# EasyEDA Pro project Sisyphus.epro, schematic Line_Follower

## Sheets
1 Sensor: Board Name: Board1; Create Date: 2024-11-08; Page Name: Sensor; Project Name: Line Follower 3; Schematic Name: Line_Follower; Update Date: 2024-11-08; Company: EasyEDA.com; Drawn: EasyEDA; Page Size: A4; Part Number: JLCPCB-002; Reviewed: EasyEDA; Version: V0.1
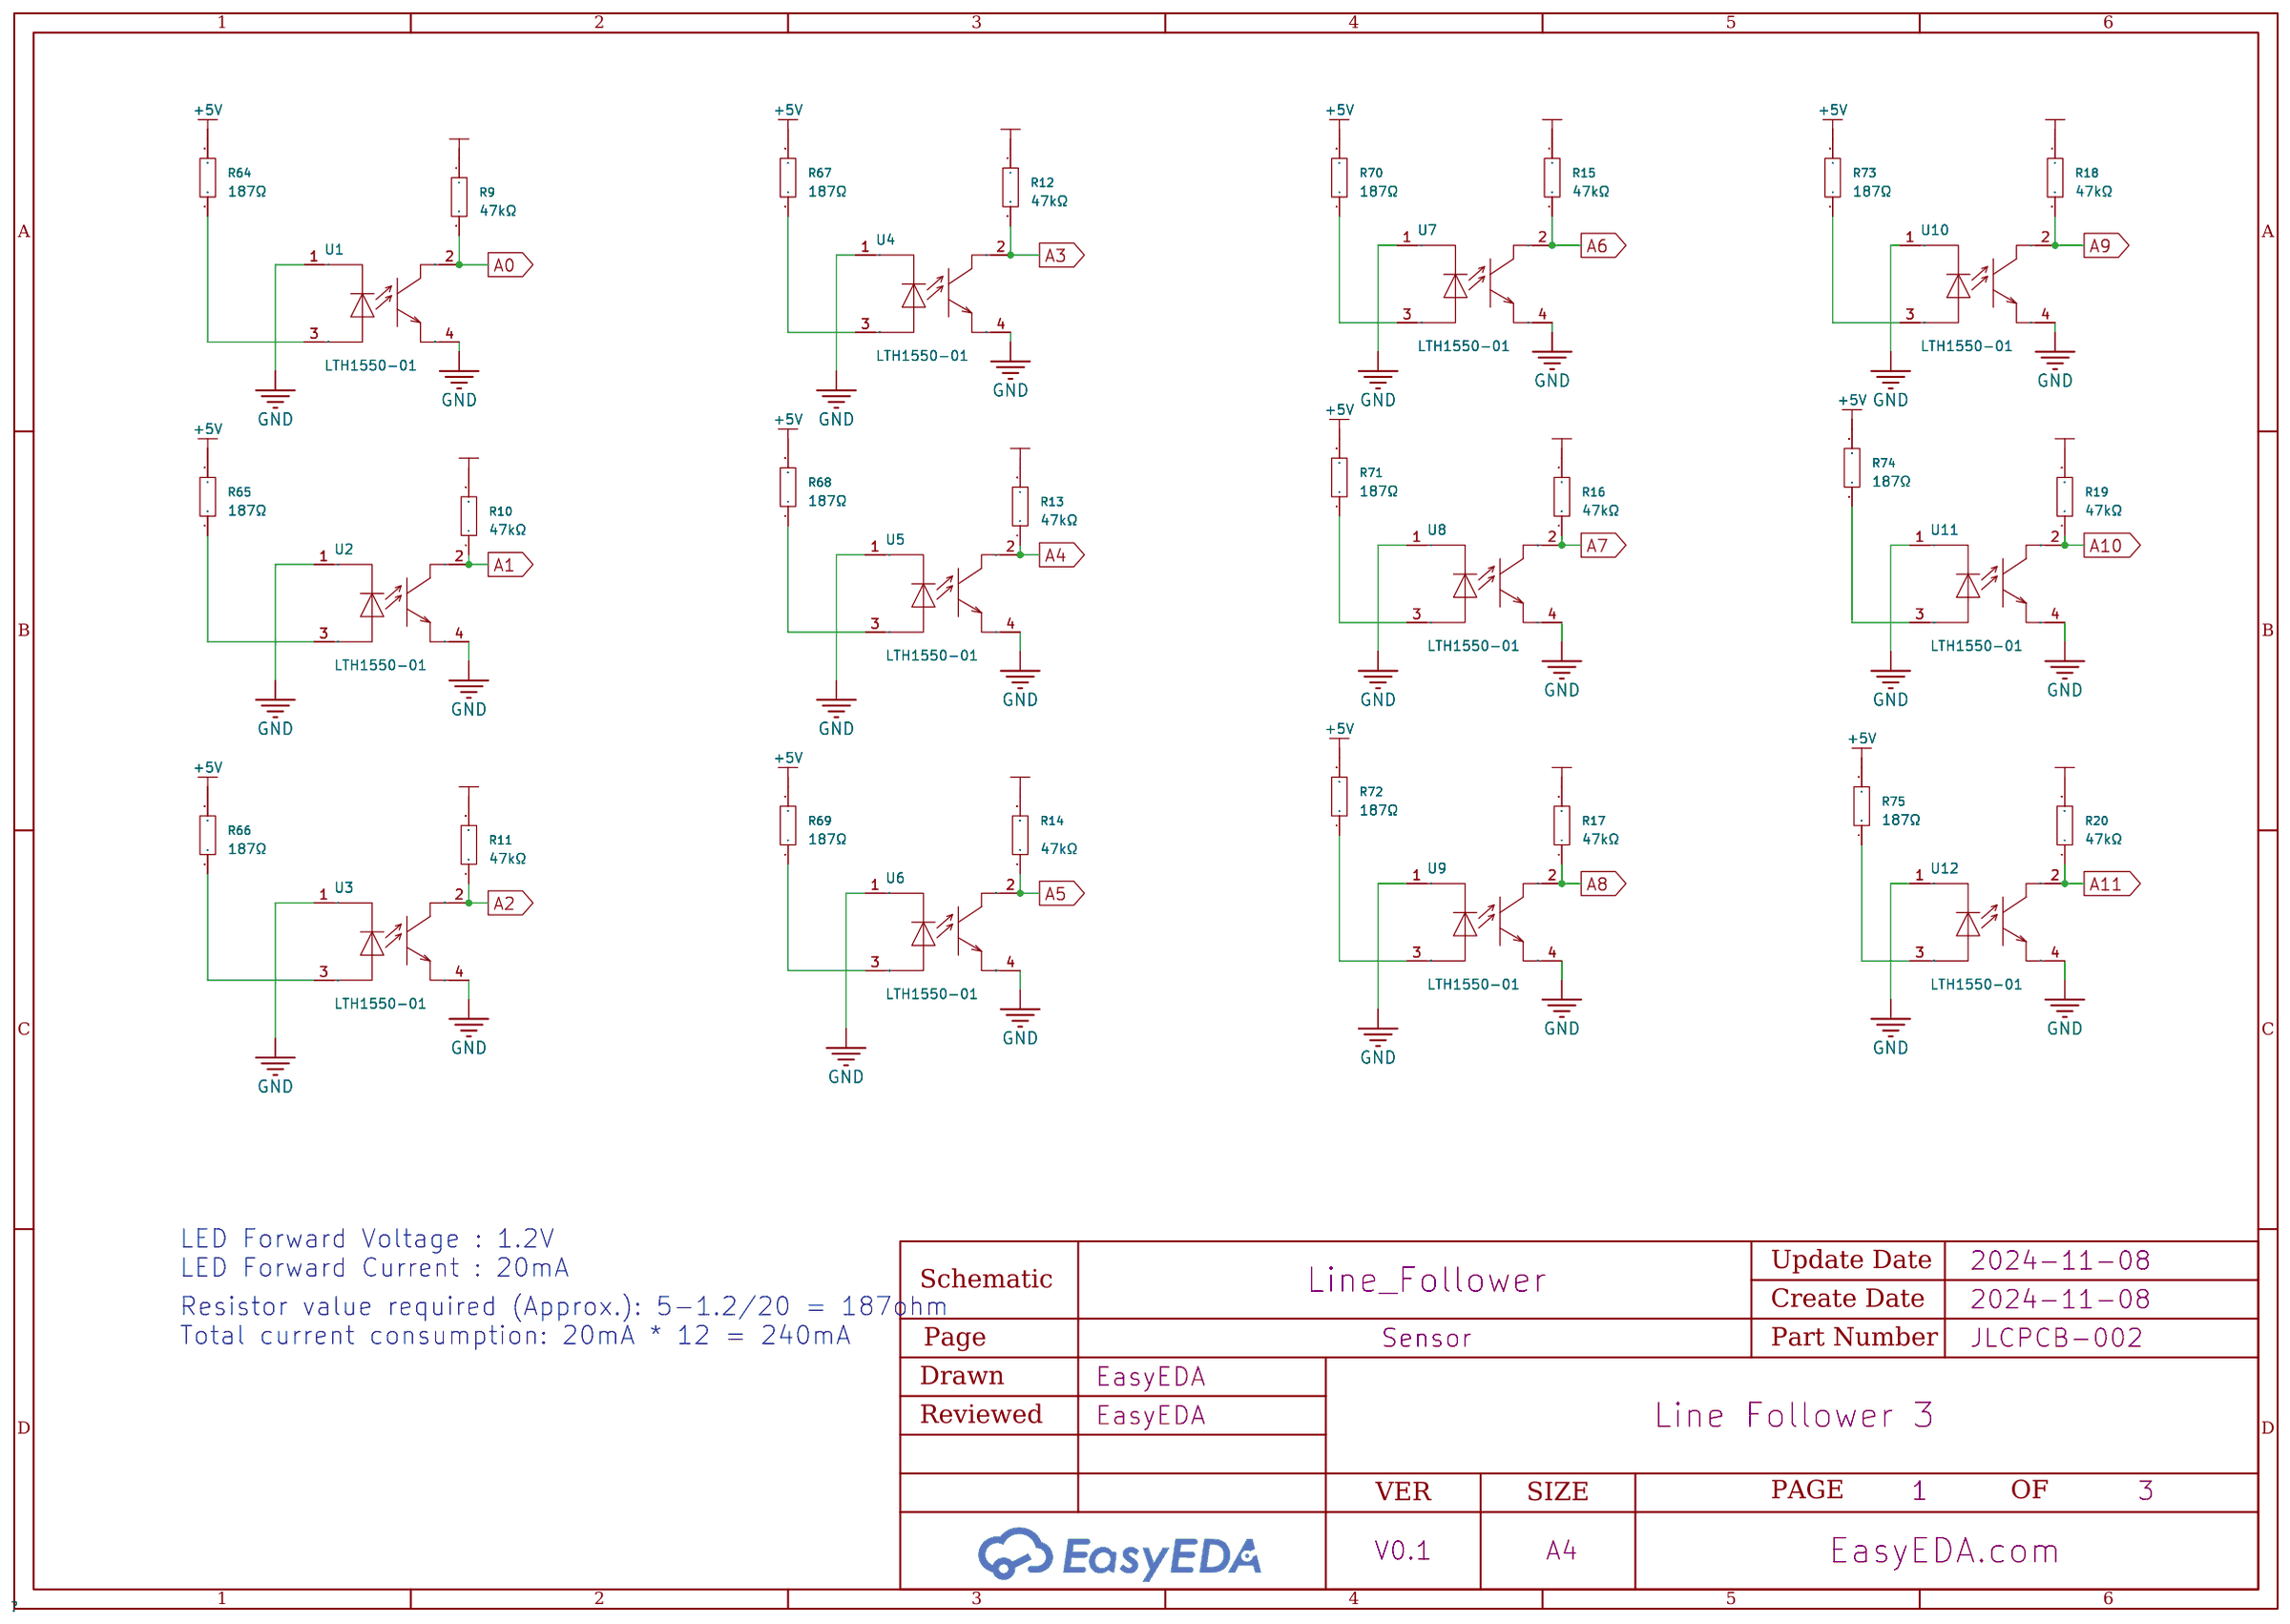
[diagram p0: Sensor]
2 MCU: Create Date: 2025-03-21; Page Name: MCU; Project Name: LineFollow; Update Date: 2025-03-21
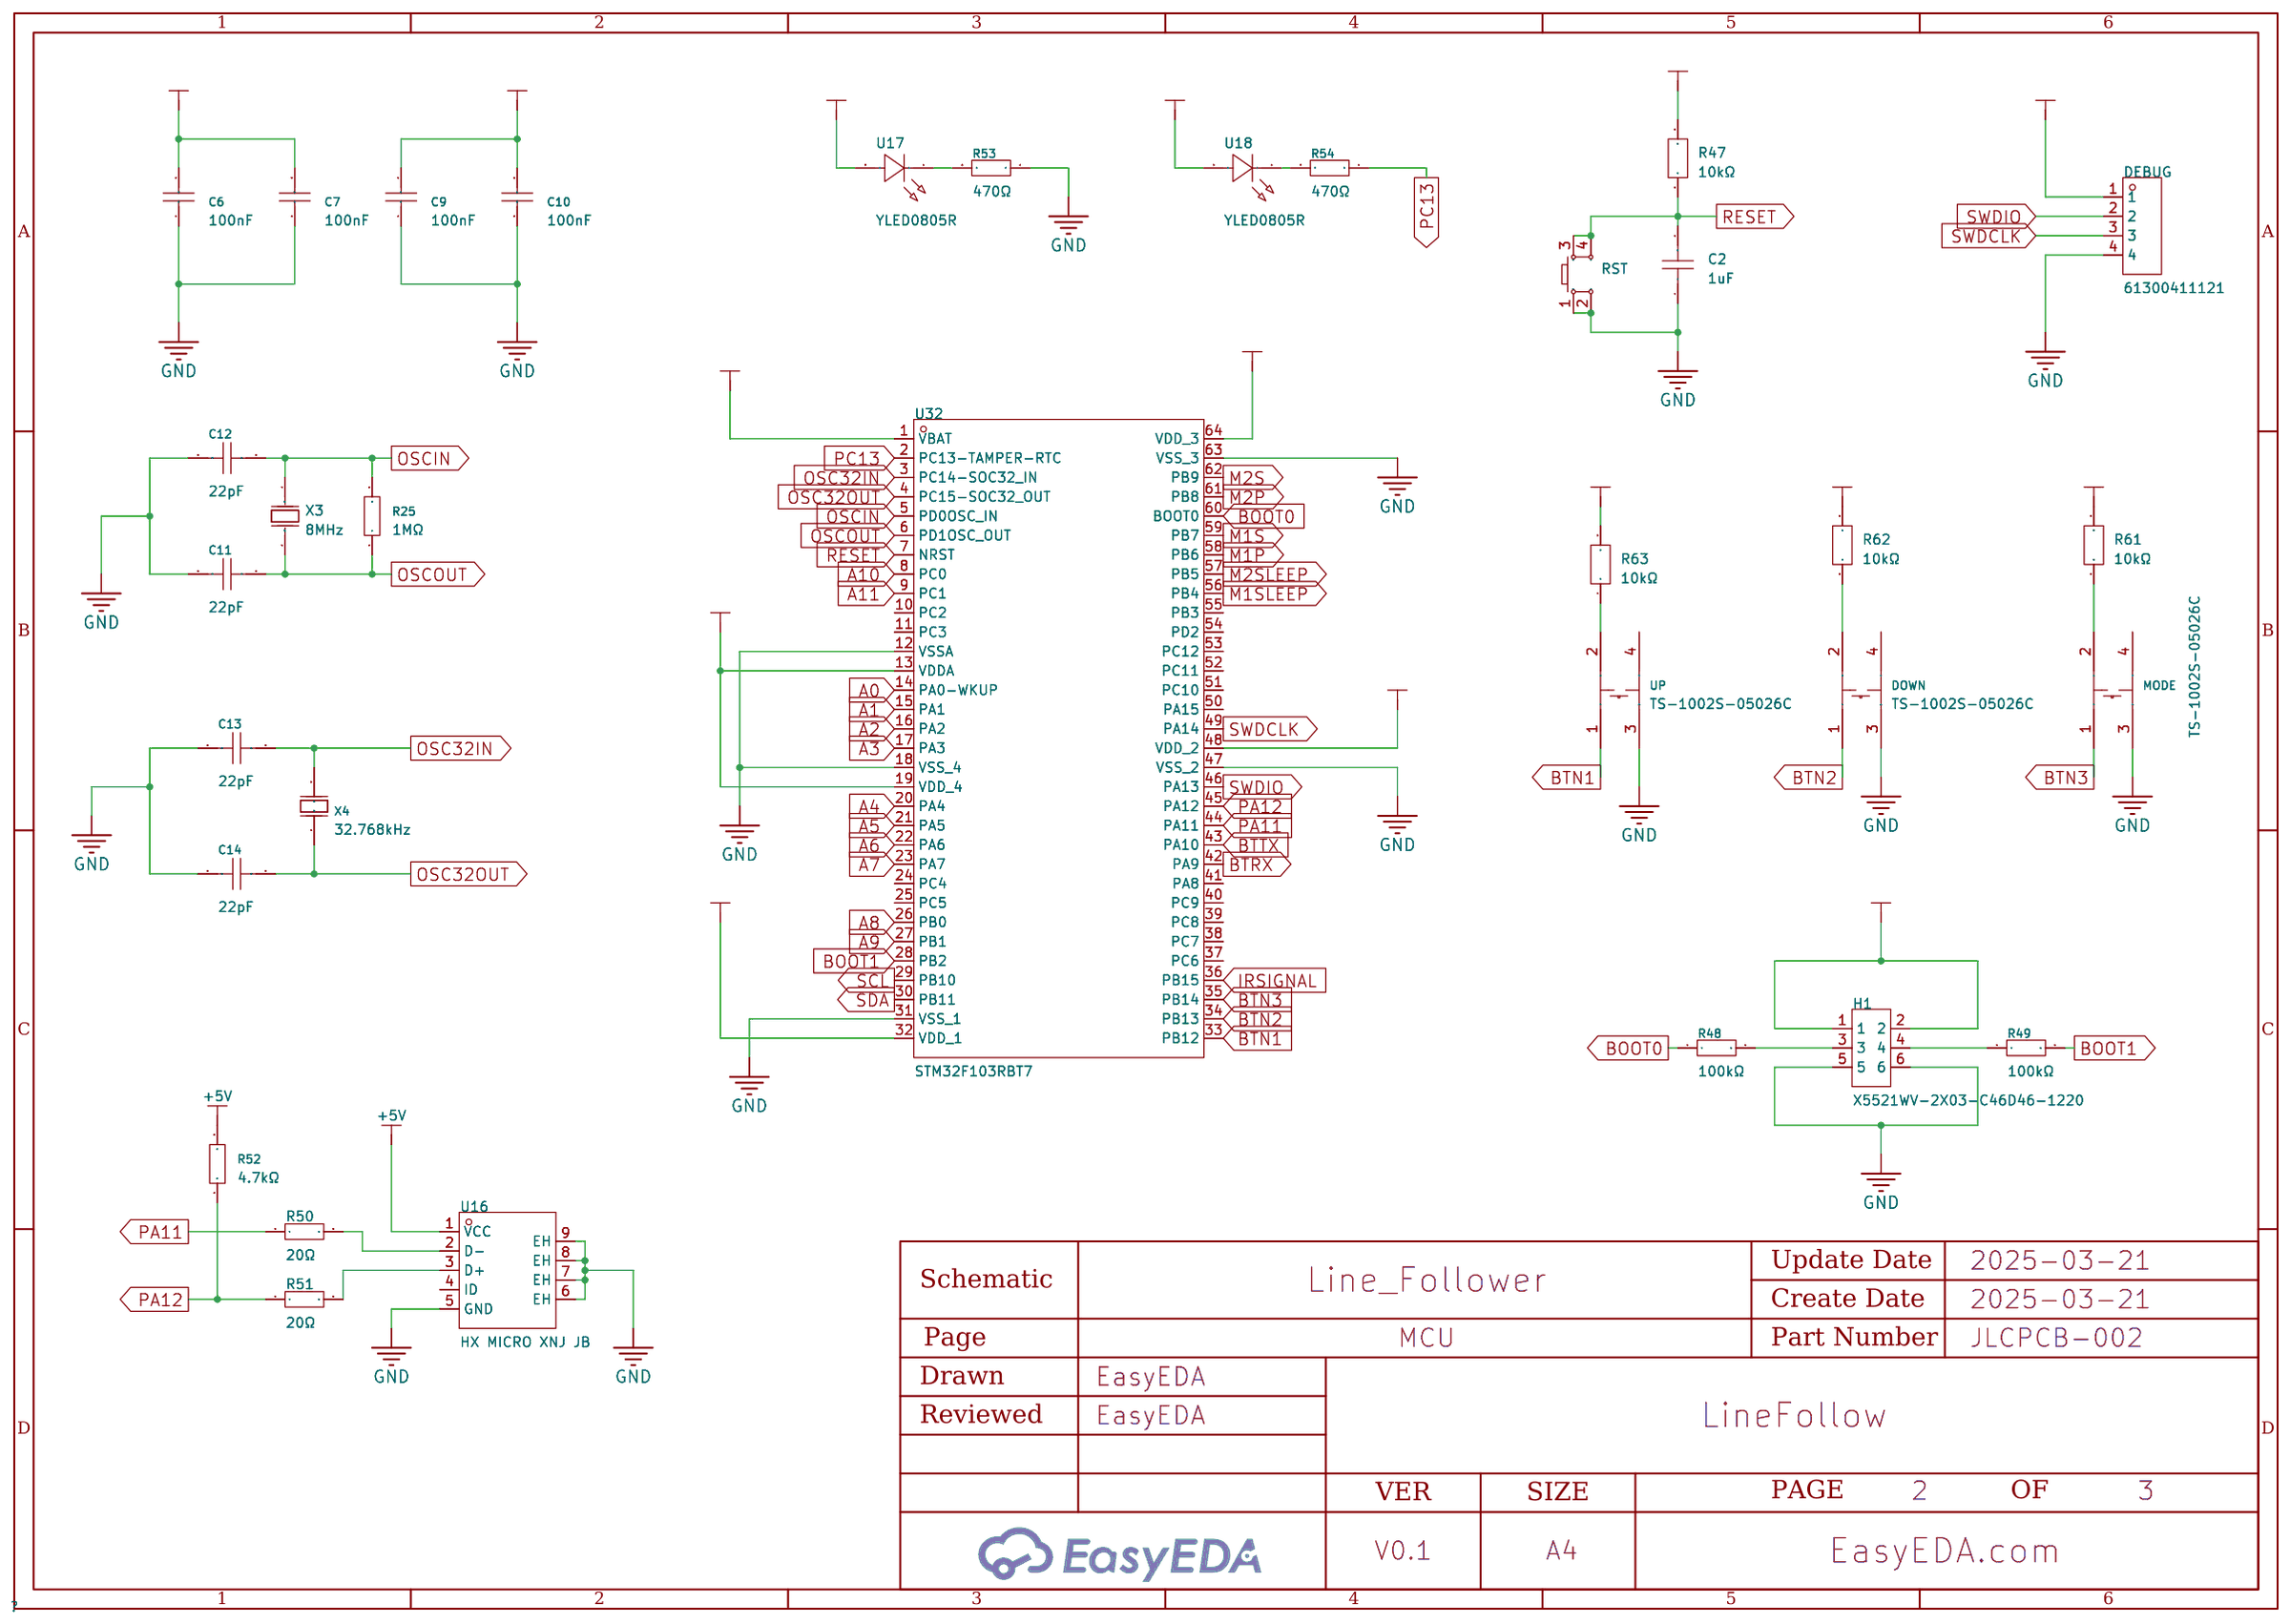
[diagram p1: MCU]
3 Power: Create Date: 2025-03-21; Page Name: Power; Project Name: LineFollow; Update Date: 2025-03-21
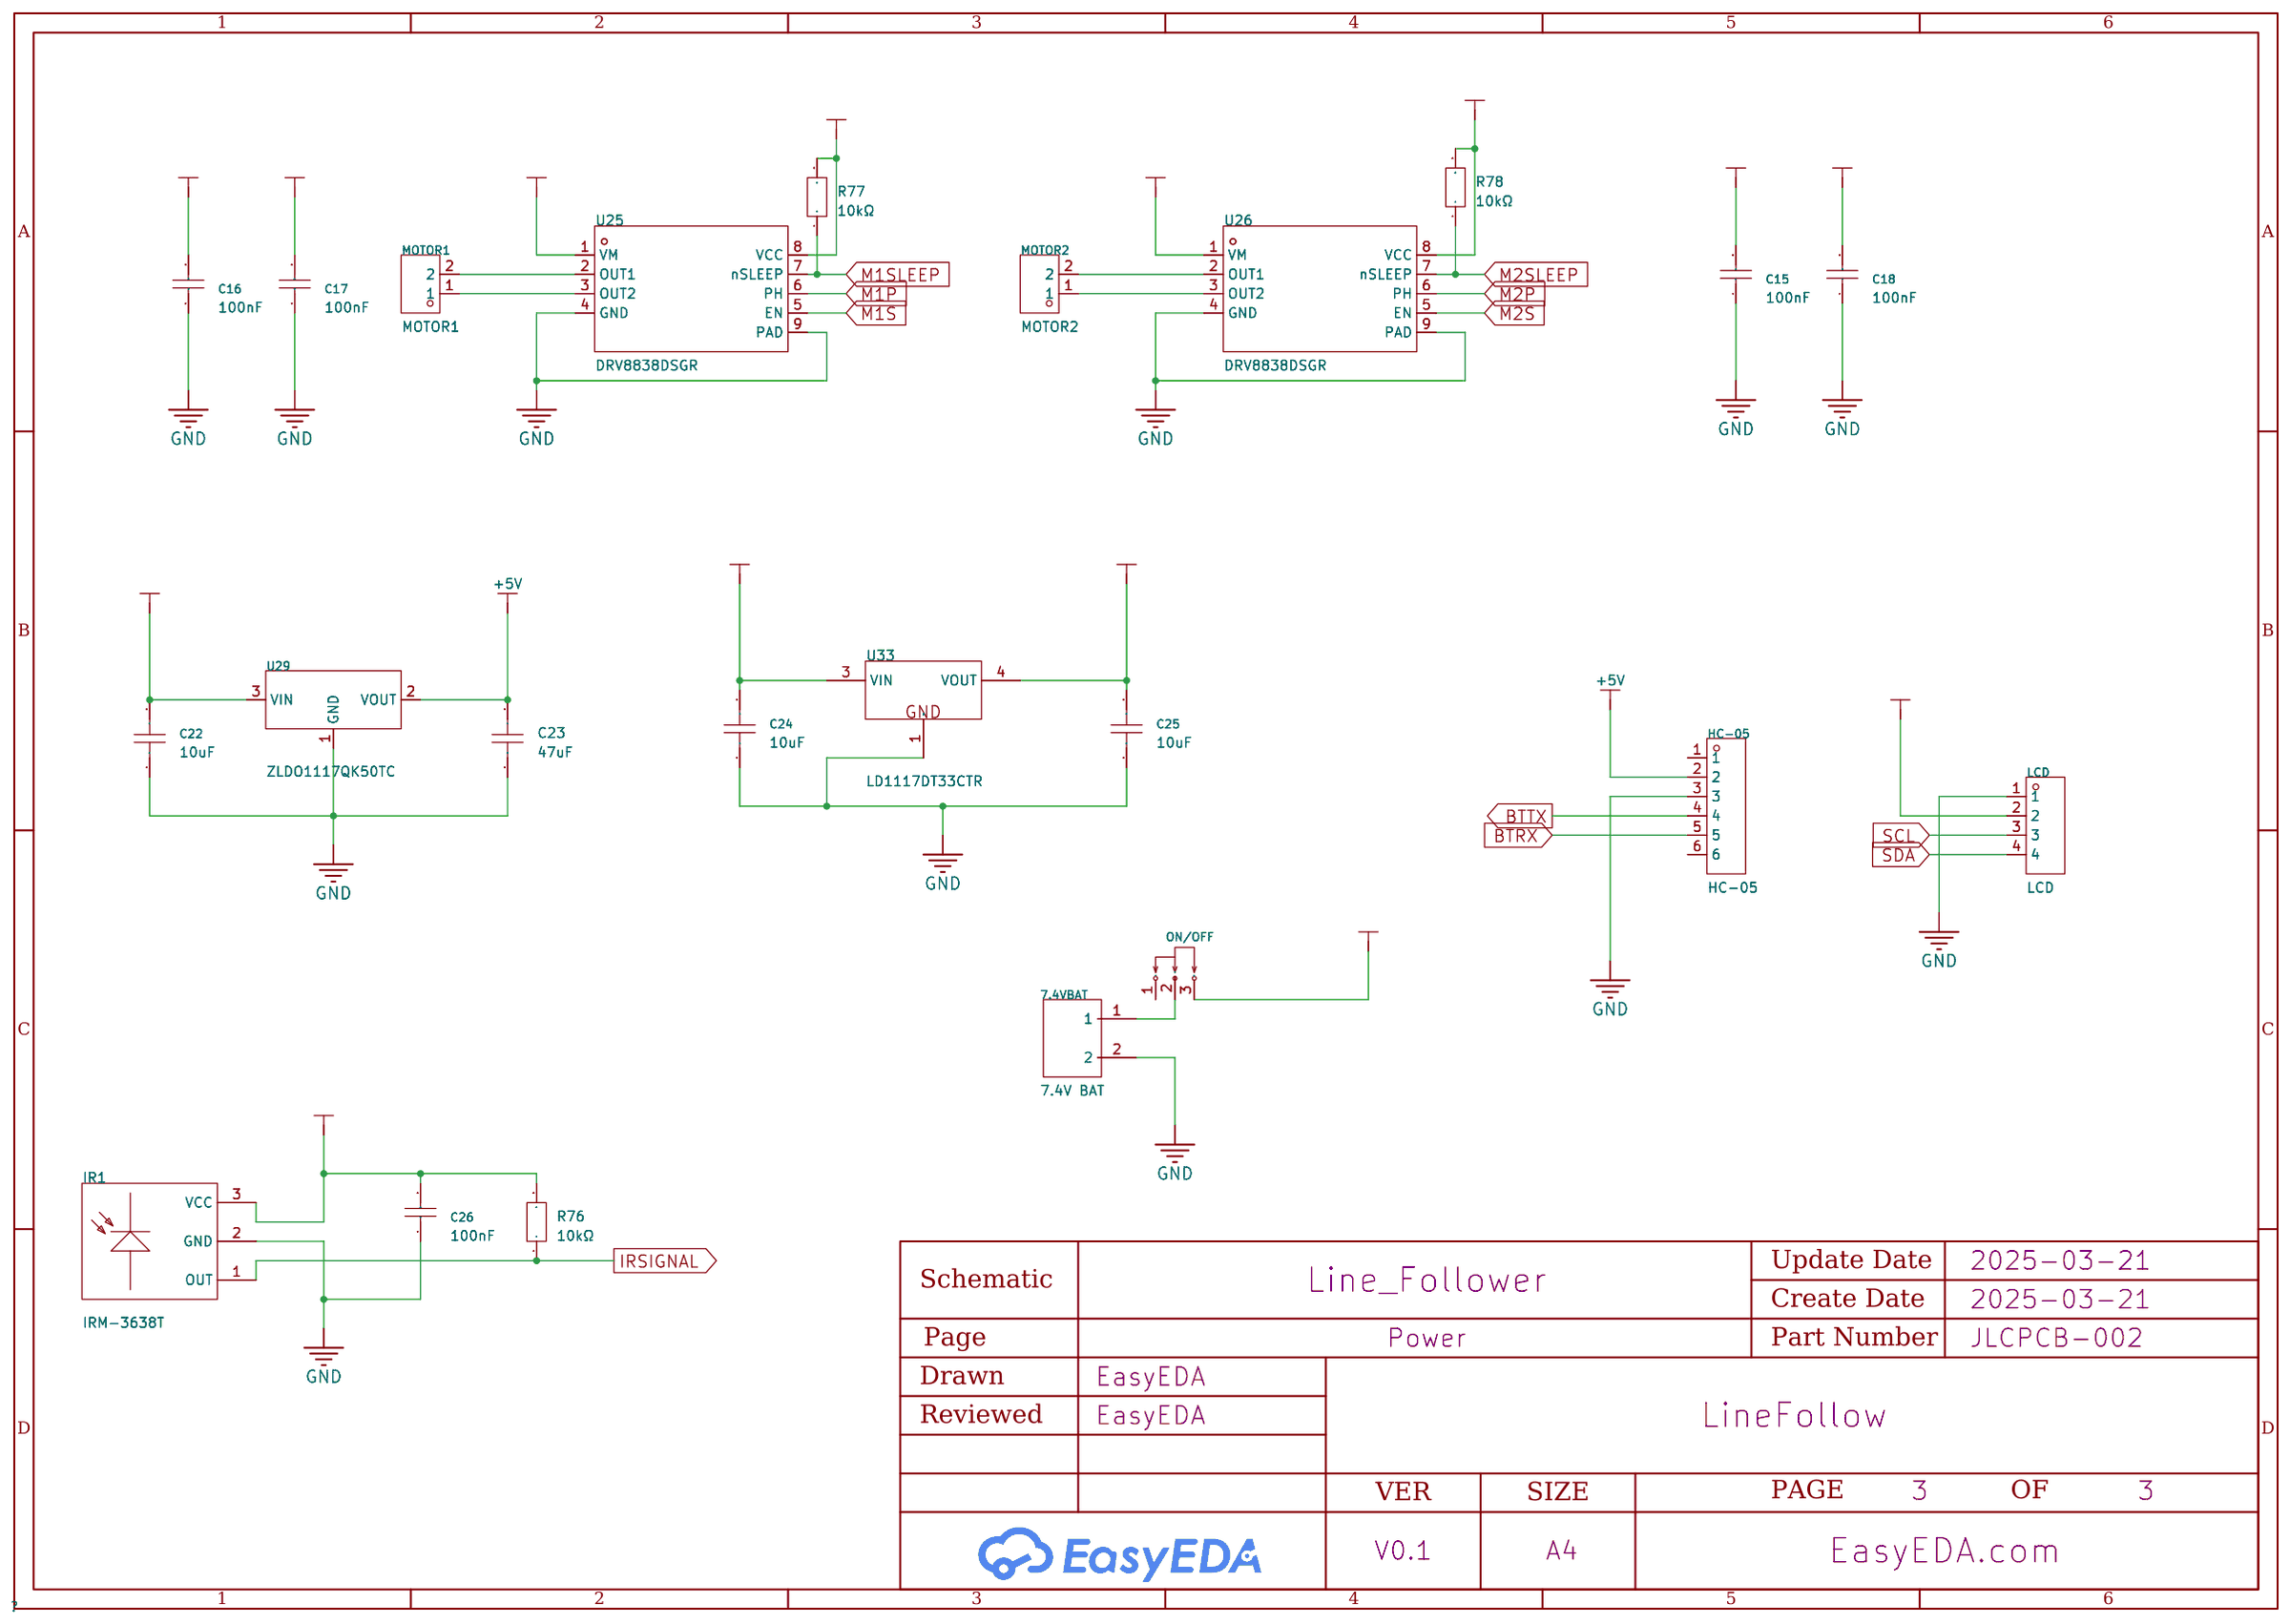
[diagram p2: Power]

## Parts
sheet MCU
C2  1uF  [C1206]
C6  100nF  [C1206]
C7  100nF  [C1206]
C9  100nF  [C1206]
C10  100nF  [C1206]
C11  22pF  [C0805]
C12  22pF  [C0805]
C13  22pF  [C0805]
C14  22pF  [C0805]
DEBUG  61300411121  [HDR-TH_4P-P2.54-V-M-1]
DOWN  TS-1002S-05026C  [KEY-SMD_4P-L6.0-W6.0-P4.50-LS9.0]
H1  X5521WV-2X03-C46D46-1220  [HDR-TH_6P-P2.54-V-M-R2-C3-S2.54-3]
MODE  TS-1002S-05026C  [KEY-SMD_4P-L6.0-W6.0-P4.50-LS9.0]
R25  1MΩ  [R1206]
R47  10kΩ  [R0805]
R48  100kΩ  [R0805]
R49  100kΩ  [R0805]
R50  20Ω  [R0805]
R51  20Ω  [R0805]
R52  4.7kΩ  [R0805]
R53  470Ω  [R0805]
R54  470Ω  [R0805]
R61  10kΩ  [R0805]
R62  10kΩ  [R0805]
R63  10kΩ  [R0805]
RST  -  [SW-SMD_4P-L6.0-W6.0-P4.50-LS9.0-2]
U16  HX MICRO XNJ JB  [MICRO-USB-SMD_MICRONJ5P-1.0-1.25]
U17  YLED0805R  [LED0805-RD]
U18  YLED0805R  [LED0805-RD]
U32  STM32F103RBT7  [LQFP-64_L10.0-W10.0-P0.50-LS12.0-BL]
UP  TS-1002S-05026C  [KEY-SMD_4P-L6.0-W6.0-P4.50-LS9.0]
X3  8MHz  [CRYSTAL-SMD_L11.5-W4.8-LS12.7]
X4  32.768kHz  [OSC-SMD_2P-L3.2-W1.5]
sheet Power
7.4VBAT  7.4V BAT  [CONN-TH_WJ126V-5.0-2P]
C15  100nF  [C1206]
C16  100nF  [C1206]
C17  100nF  [C1206]
C18  100nF  [C1206]
C22  10uF  [C0805]
C23  47uF  [C1206]
C24  10uF  [C0805]
C25  10uF  [C0805]
C26  100nF  [C1206]
HC-05  HC-05  [HDR-TH_6P-P2.54-V-F]
IR1  IRM-3638T  [OPTO-TH_IRM-3638T]
LCD  LCD  [HDR-TH_4P-P2.54-V-F]
MOTOR1  MOTOR1  [HDR-TH_2P-P2.54-V-M]
MOTOR2  MOTOR2  [HDR-TH_2P-P2.54-V-M]
ON/OFF  SS12D10G4 071  [SW-TH_SHOU-HAN_SS12D10G4]
R76  10kΩ  [R0805]
R77  10kΩ  [R0805]
R78  10kΩ  [R0805]
U25  DRV8838DSGR  [WSON-8_L2.0-W2.0-P0.50-TL-EP]
U26  DRV8838DSGR  [WSON-8_L2.0-W2.0-P0.50-TL-EP]
U29  ZLDO1117QK50TC  [TO-252-3_L6.6-W6.1-P4.57-LS9.9-BR-CW]
U33  LD1117DT33CTR  [TO-252-2_L6.5-W6.1-P4.58-LS10.0-TL]
sheet Sensor
R9  47kΩ  [R0805]
R10  47kΩ  [R0805]
R11  47kΩ  [R0805]
R12  47kΩ  [R0805]
R13  47kΩ  [R0805]
R14  47kΩ  [R0805]
R15  47kΩ  [R0805]
R16  47kΩ  [R0805]
R17  47kΩ  [R0805]
R18  47kΩ  [R0805]
R19  47kΩ  [R0805]
R20  47kΩ  [R0805]
R64  187Ω  [R0805]
R65  187Ω  [R0805]
R66  187Ω  [R0805]
R67  187Ω  [R0805]
R68  187Ω  [R0805]
R69  187Ω  [R0805]
R70  187Ω  [R0805]
R71  187Ω  [R0805]
R72  187Ω  [R0805]
R73  187Ω  [R0805]
R74  187Ω  [R0805]
R75  187Ω  [R0805]
U1  LTH1550-01  [OPTO-TH_4P-L8.7-W4.5-P4.10_LTH1550-01]
U2  LTH1550-01  [OPTO-TH_4P-L8.7-W4.5-P4.10_LTH1550-01]
U3  LTH1550-01  [OPTO-TH_4P-L8.7-W4.5-P4.10_LTH1550-01]
U4  LTH1550-01  [OPTO-TH_4P-L8.7-W4.5-P4.10_LTH1550-01]
U5  LTH1550-01  [OPTO-TH_4P-L8.7-W4.5-P4.10_LTH1550-01]
U6  LTH1550-01  [OPTO-TH_4P-L8.7-W4.5-P4.10_LTH1550-01]
U7  LTH1550-01  [OPTO-TH_4P-L8.7-W4.5-P4.10_LTH1550-01]
U8  LTH1550-01  [OPTO-TH_4P-L8.7-W4.5-P4.10_LTH1550-01]
U9  LTH1550-01  [OPTO-TH_4P-L8.7-W4.5-P4.10_LTH1550-01]
U10  LTH1550-01  [OPTO-TH_4P-L8.7-W4.5-P4.10_LTH1550-01]
U11  LTH1550-01  [OPTO-TH_4P-L8.7-W4.5-P4.10_LTH1550-01]
U12  LTH1550-01  [OPTO-TH_4P-L8.7-W4.5-P4.10_LTH1550-01]

## Library data of the parts
C2 = CL31B105KBHNNNE: Capacitance: Tolerance:±10% Tolerance:±10% Voltage Rated: Temperature Coefficient:; LCSC Part Name: 1uF ±10% 50V; Supplier Part: C1848; Manufacturer: SAMSUNG(三星); Supplier Footprint: 1206; JLCPCB Part Class: Basic Part; Datasheet: https://atta.szlcsc.com/upload/public/pdf/source/20160218/1457707763339.pdf; Supplier: LCSC; Tolerance: ±10%
C6 C7 C9 C10 C15-C18 C26 = CL31B104KBCNNNC: Capacitance: Tolerance:±10% Tolerance:±10% Voltage Rated: Temperature Coefficient:; LCSC Part Name: 100nF ±10% 50V; Supplier Part: C24497; Manufacturer: SAMSUNG(三星); Supplier Footprint: 1206; JLCPCB Part Class: Basic Part; Datasheet: https://atta.szlcsc.com/upload/public/pdf/source/20160218/1457707763339.pdf; Supplier: LCSC; Tolerance: ±10%
C11-C14 = TCC0805COG220J500BT: Capacitance: Tolerance:±5% Tolerance:±5% Voltage Rated: Temperature Coefficient:; LCSC Part Name: 22pF ±5% 50V; Supplier Part: C376875; Manufacturer: CCTC(三环); Supplier Footprint: 0805; JLCPCB Part Class: Extended Part; Datasheet: https://atta.szlcsc.com/upload/public/pdf/source/20191203/C466239_F62A586702D44EEA1C39B32FC8662B21.pdf; Supplier: LCSC; Tolerance: ±5%
DEBUG = 61300411121: Supplier Part: C5184785; Manufacturer: Wurth(伍尔特); Supplier Footprint: 插件,P=2.54mm; JLCPCB Part Class: Extended Part; Supplier: LCSC
DOWN MODE UP = TS-1002S-05026C: Circuit:SPST Actuator Style:Round Button Mounting Style:Brick nogging Switch Length:6mm Switch Width:6mm Switch Height:5mm Contact Current:50mA Voltage Rating (DC):12V With Lamp:- Mechanical Life:-; LCSC Part Name: 6*6*5mm 立贴 轻触开关; Supplier Part: C455110; Manufacturer: XUNPU(讯普); Supplier Footprint: SMD,6x6mm; JLCPCB Part Class: Extended Part; Datasheet: https://atta.szlcsc.com/upload/public/pdf/source/20191118/C455126_F61E8FA1ED640FB1CE0B30B55DEB62E3.pdf; Supplier: LCSC; Circuit: SPST; Actuator Style: Round Button; Mounting Style: Brick nogging; Switch Length: 6mm; Switch Width: 6mm; Switch Height: 5mm; Contact Current: 50mA; Voltage Rating (DC): 12V
H1 = X5521WV-2X03-C46D46-1220: Pin Structure:2x3P Pitch:2.54mm Row Spacing:2.54mm Circluar Pins/Square Pins:Policy Number of Rows:Double Row Number of Pins:6P Current Rating:3A Voltage Rating (Max):250V Length of Mating Pin:- Insulation Height:3mm Length of End Connection Pin:- Contact; LCSC Part Name: 2x3P 间距:2.54mm 方针; Supplier Part: C2764584; Manufacturer: XKB Connection(中国星坤); Supplier Footprint: 插件,P=2.54mm; JLCPCB Part Class: Extended Part; Datasheet: https://atta.szlcsc.com/upload/public/pdf/source/20210413/C2764590_C40F5DCEC1017E64491F3503C7E39A39.pdf; Supplier: LCSC; Pin Structure: 2x3P; Pitch: 2.54mm; Row Spacing: 2.54mm; Circluar Pins/Square Pins: Policy; Number of Rows: Double Row; Number of Pins: 6P; Current Rating: 3A; Voltage Rating (Max): 250V; Insulation Height: 3mm; Contact Material: Brass; Contact Plating: Gold; Operating Temperature: -40℃~+105℃; Color: Black
R25 = 1206W4F1004T5E: Type:Thick Film Resistors Resistance:1MΩ Tolerance:±1% Tolerance:±1% Power(Watts): Overload Voltage (Max): Temperature Coefficient:±100ppm/℃ Temperature Coefficient:±100ppm/℃ Operating Temperature Range:-55℃~+155℃ Operating Temperature Range:-55℃~+155℃; LCSC Part Name: 1MΩ ±1% 250mW 厚膜电阻; Supplier Part: C17927; Manufacturer: UNI-ROYAL(厚声); Supplier Footprint: 1206; JLCPCB Part Class: Basic Part; Datasheet: https://atta.szlcsc.com/upload/public/pdf/source/20200306/C422600_1E6D84923E4A46A82E41ADD87F860B5C.pdf; Supplier: LCSC; Type: Thick Film Resistors; Tolerance: ±1%; Temperature Coefficient: ±100ppm/℃; Operating Temperature Range: -55℃~+155℃
R47 R61-R63 R76-R78 = FRC0805J103TS: Type:Thick Film Resistors Resistance:10kΩ Tolerance:±5% Tolerance:±5% Power(Watts): Overload Voltage (Max): Temperature Coefficient:±100ppm/℃ Temperature Coefficient:±100ppm/℃ Operating Temperature Range:-55℃~+155℃ Operating Temperature Range:-55℃~+155℃; LCSC Part Name: 10kΩ ±5% 125mW 厚膜电阻; Supplier Part: C2930231; Manufacturer: FOJAN(富捷); Supplier Footprint: 0805; JLCPCB Part Class: Extended Part; Datasheet: https://atta.szlcsc.com/upload/public/pdf/source/20211221/925EC7D7225764EE0046F22065062C87.pdf; Supplier: LCSC; Type: Thick Film Resistors; Tolerance: ±5%; Temperature Coefficient: ±100ppm/℃; Operating Temperature Range: -55℃~+155℃
R48 R49 = 0805W8F1003T5E: Type:Thick Film Resistors Resistance:100kΩ Tolerance:±1% Tolerance:±1% Power(Watts): Overload Voltage (Max): Temperature Coefficient:±100ppm/℃ Temperature Coefficient:±100ppm/℃ Operating Temperature Range:-55℃~+155℃ Operating Temperature Range:-55℃~+155℃; LCSC Part Name: 100kΩ ±1% 125mW 厚膜电阻; Supplier Part: C149504; Manufacturer: UNI-ROYAL(厚声); Supplier Footprint: 0805; JLCPCB Part Class: Basic Part; Datasheet: https://atta.szlcsc.com/upload/public/pdf/source/20200306/C422600_1E6D84923E4A46A82E41ADD87F860B5C.pdf; Supplier: LCSC; Type: Thick Film Resistors; Tolerance: ±1%; Temperature Coefficient: ±100ppm/℃; Operating Temperature Range: -55℃~+155℃
R50 R51 = RS-05K20R0FT: Type:Thick Film Resistors Resistance: Tolerance:±1% Tolerance:±1% Power(Watts): Overload Voltage (Max): Temperature Coefficient:±100ppm/℃ Temperature Coefficient:±100ppm/℃ Operating Temperature Range:-55℃~+155℃ Operating Temperature Range:-55℃~+155℃; LCSC Part Name: 厚膜电阻 20Ω ±1% 125mW; Supplier Part: C136607; Manufacturer: FH(风华); Supplier Footprint: 0805; JLCPCB Part Class: Extended Part; Datasheet: https://atta.szlcsc.com/upload/public/pdf/source/20140616/1457707091974.pdf; Supplier: LCSC; Type: Thick Film Resistors; Tolerance: ±1%; Temperature Coefficient: ±100ppm/℃; Operating Temperature Range: -55℃~+155℃
R52 = 0805W8F4701T5E: Type:Thick Film Resistors Resistance:4.7kΩ Tolerance:±1% Tolerance:±1% Power(Watts): Overload Voltage (Max): Temperature Coefficient:±100ppm/℃ Temperature Coefficient:±100ppm/℃ Operating Temperature Range:-55℃~+155℃ Operating Temperature Range:-55℃~+155℃; LCSC Part Name: 4.7kΩ ±1% 125mW 厚膜电阻; Supplier Part: C17673; Manufacturer: UNI-ROYAL(厚声); Supplier Footprint: 0805; JLCPCB Part Class: Basic Part; Datasheet: https://atta.szlcsc.com/upload/public/pdf/source/20200306/C422600_1E6D84923E4A46A82E41ADD87F860B5C.pdf; Supplier: LCSC; Type: Thick Film Resistors; Tolerance: ±1%; Temperature Coefficient: ±100ppm/℃; Operating Temperature Range: -55℃~+155℃
R53 R54 = 0805W8F4700T5E: Type:Thick Film Resistors Resistance: Tolerance:±1% Tolerance:±1% Power(Watts): Overload Voltage (Max): Temperature Coefficient:±100ppm/℃ Temperature Coefficient:±100ppm/℃ Operating Temperature Range:-55℃~+155℃ Operating Temperature Range:-55℃~+155℃; LCSC Part Name: 470Ω ±1% 125mW 厚膜电阻; Supplier Part: C17710; Manufacturer: UNI-ROYAL(厚声); Supplier Footprint: 0805; JLCPCB Part Class: Basic Part; Datasheet: https://atta.szlcsc.com/upload/public/pdf/source/20200306/C422600_1E6D84923E4A46A82E41ADD87F860B5C.pdf; Supplier: LCSC; Type: Thick Film Resistors; Tolerance: ±1%; Temperature Coefficient: ±100ppm/℃; Operating Temperature Range: -55℃~+155℃
RST = Key_SMD_6x6x6.5: Supplier Footprint: SMD
U16 = HX MICRO XNJ JB: Connector Type:Micro-B Gender:Female; LCSC Part Name: Micro-B 母; Supplier Part: C5160305; Manufacturer: hanxia(韩下); Supplier Footprint: SMD; JLCPCB Part Class: Extended Part; Datasheet: https://atta.szlcsc.com/upload/public/pdf/source/20220913/52645552CAE40EE2821654B8B5D78998.pdf; Supplier: LCSC; Connector Type: Micro-B; Gender: Female
U17 U18 = YLED0805R: Emitted Color:Red Forward Voltage (VF):1.8V~2.4V Forward Voltage (VF):1.8V~2.4V Power Dissipation:60mW Forward Current:20mA Dominant Wavelength:615nm~630nm Dominant Wavelength:615nm~630nm Peak Wavelength:645nm Diode Configuration:- Lens Color:- Color Temp; Supplier Part: C19171391; Manufacturer: YONGYUTAI(永裕泰); Supplier Footprint: 0805; JLCPCB Part Class: Extended Part; Datasheet: https://atta.szlcsc.com/upload/public/pdf/source/20231027/AB486D22E6D71BC59190C48A798367E6.pdf; Supplier: LCSC; Emitted Color: Red; Forward Voltage (VF): 1.8V~2.4V; Power Dissipation: 60mW; Forward Current: 20mA; Dominant Wavelength: 615nm~630nm; Peak Wavelength: 645nm; Operating Temperature: -40℃~+85℃
U32 = STM32F103RBT7: CPU Core:ARM-M3 Program Storage Size:128KB RAM Size:20KB GPIO Ports Number:51 Operating Voltage Range:2V~3.6V Operating Voltage Range:2V~3.6V CPU Maximum Speed:72MHz Program Memory Type:FLASH Operating Temperature Range:-40℃~+105℃ Operating Temperature Ra; LCSC Part Name: 主流增强型ARM Cortex-M3 MCU，具有128 KB Flash、72 MHz CPU、电机控制、USB和CAN; Supplier Part: C1337624; Manufacturer: ST(意法半导体); Supplier Footprint: LQFP-64(10x10); JLCPCB Part Class: Extended Part; Datasheet: https://atta.szlcsc.com/upload/public/pdf/source/20191108/C446030_27D91C05707EDD0145409FE106B48E64.pdf; Supplier: LCSC; CPU Core: ARM-M3; Program Storage Size: 128KB; RAM Size: 20KB; GPIO Ports Number: 51; Operating Voltage Range: 2V~3.6V; CPU Maximum Speed: 72MHz; Program Memory Type: FLASH; Operating Temperature Range: -40℃~+105℃; ADC (Bit): 12bit; Universal Serial Bus: Yes; Peripheral/Function: DMA；Temperature Sensor；PWM; Watchdog: Yes; Infrared Data Association: Yes; Low-Voltage Detect: Yes; Direct Memory Access: Yes; Internal Oscillator: Yes
X3 = X49SM8MSD2SC: Crystal Type:Surface Mount Crystal Frequency: Normal temperature Frequency Tolerance:±20ppm Normal temperature Frequency Tolerance:±20ppm External load capacitor: Frequency Stability(Full temperature range):±30ppm Frequency Stability(Full temperature rang; LCSC Part Name: 8MHz ±20ppm 20pF; Supplier Part: C12674; Manufacturer: YXC(扬兴晶振); Supplier Footprint: HC-49S-SMD; JLCPCB Part Class: Basic Part; Datasheet: https://atta.szlcsc.com/upload/public/pdf/source/20240329/3EBF42EBCAB50CA65B6FA9D7CFA1955A.pdf; Supplier: LCSC; Crystal Type: Surface Mount Crystal; Normal temperature Frequency Tolerance: ±20ppm; Frequency Stability(Full temperature range): ±30ppm
X4 = ABS07-32.768KHZ-T: Crystal Type:贴片晶振 Frequency: Normal temperature Frequency Tolerance:±20ppm Normal temperature Frequency Tolerance:±20ppm External load capacitor: Frequency Stability(Full temperature range):- Frequency Stability(Full temperature range):- Equivalent Series; LCSC Part Name: 32.768kHz ±20ppm 12.5pF; Supplier Part: C130253; Manufacturer: ABRACON; Supplier Footprint: SMD3215-2P; JLCPCB Part Class: Extended Part; Datasheet: https://atta.szlcsc.com/upload/public/pdf/source/20180906/C276424_248D5DF2C4B6F2E5DB9021C295D5D581.pdf; Supplier: LCSC; Crystal Type: 贴片晶振; Normal temperature Frequency Tolerance: ±20ppm; Equivalent Series Resistance (ESR): 70kΩ
7.4VBAT = WJ126V-5.0-2P: Structure:1x2P Pitch:5mm Color:Green Mounting Style:Straight Current Rating (Max):18A Voltage Rating (Max):250V Number of Pins:2P Number of Rows:1 Wire Gauge - AWG:14~26 Wire Gauge - AWG:14~26 Wire Gauge - mm2:2.5 Wire Gauge - mm2:2.5 Number of PINs Per R; LCSC Part Name: 5mm 1x2P 排数:1 每排P数:2 直插; Supplier Part: C8404; Manufacturer: KANGNEX(康奈克斯电气); Supplier Footprint: 插件,P=5mm; JLCPCB Part Class: Extended Part; Datasheet: https://atta.szlcsc.com/upload/public/pdf/source/20191225/C8404_8F52D87DF851D149A4DEA9BD9FA83F9A.pdf; Supplier: LCSC; Structure: 1x2P; Pitch: 5mm; Color: Green; Mounting Style: Straight; Current Rating (Max): 18A; Voltage Rating (Max): 250V; Number of Pins: 2P; Number of Rows: 1; Wire Gauge - AWG: 14~26; Wire Gauge - mm2: 2.5; Number of PINs Per Row: 2; Operating Temperature Range: -40℃~+105℃
C22 C24 C25 = GRM21BR61E106KA73L: Capacitance: Tolerance:±10% Tolerance:±10% Voltage Rated: Temperature Coefficient:; LCSC Part Name: 10uF ±10% 25V; Supplier Part: C84416; Manufacturer: muRata(村田); Supplier Footprint: 0805; JLCPCB Part Class: Extended Part; Datasheet: https://atta.szlcsc.com/upload/public/pdf/source/20161024/1477288637384.pdf; Supplier: LCSC; Tolerance: ±10%
C23 = GRM31CR61E476ME44L: Capacitance: Tolerance:±20% Tolerance:±20% Voltage Rated: Temperature Coefficient:; LCSC Part Name: 47uF ±20% 25V; Supplier Part: C403725; Manufacturer: muRata(村田); Supplier Footprint: 1206; JLCPCB Part Class: Extended Part; Datasheet: https://atta.szlcsc.com/upload/public/pdf/source/20191025/C403725_B8A8CD2FFA1F57E6FDF268BD106459D5.pdf; Supplier: LCSC; Tolerance: ±20%
HC-05 = 2.54-1*6P母: Holes Structure:1x6P Pitch:2.54mm Row Spacing:- Mounting Type:Straight Number of Rows:Plugin Number of Holes:6P Insulation Height:- Contact Material:- Contact Plating:-; LCSC Part Name: 间距:2.54mm 1x6P 直插; Supplier Part: C40877; Manufacturer: BOOMELE(博穆精密); Supplier Footprint: 插件,P=2.54mm; JLCPCB Part Class: Extended Part; Datasheet: https://atta.szlcsc.com/upload/public/pdf/source/20210301/C2718488_F4427B881E42CAA8DDB0B1C12B3A522C.pdf; Supplier: LCSC; Holes Structure: 1x6P; Pitch: 2.54mm; Mounting Type: Straight; Number of Rows: Plugin; Number of Holes: 6P
IR1 = IRM-3638T: Voltage - Supply:2.7V~5.5V Voltage - Supply:2.7V~5.5V Supply Current:450uA Transmission Distance:6m Frequency - Center:38kHz Viewing Angle:±35°@Vertical；±35°@Horizontal Pd - Power Dissipation:- Operating Temperature:-20℃~+80℃ Operating Temperature:-20℃~+8; LCSC Part Name: 接收距离6m ±35°@水平 ±35°@垂直; Supplier Part: C16216; Manufacturer: EVERLIGHT(亿光); Supplier Footprint: SIP-3-2.54mm; JLCPCB Part Class: Extended Part; Supplier: LCSC; Voltage - Supply: 2.7V~5.5V; Supply Current: 450uA; Transmission Distance: 6m; Frequency - Center: 38kHz; Viewing Angle: ±35°@Vertical；±35°@Horizontal; Operating Temperature: -20℃~+80℃
LCD = 2.54-1*4P母: Holes Structure:1x4P Pitch:2.54mm Row Spacing:- Circular Hole / Square Hole:Square Holes Mounting Type:Straight Number of Rows:Plugin Number of Holes:4P Current Rating (Max):3A Voltage Rating (Max):- Holes Direction:Top Insulation Height:- Contact Materia; LCSC Part Name: 间距:2.54mm 1x4P 直插; Supplier Part: C2718488; Manufacturer: BOOMELE(博穆精密); Supplier Footprint: 插件,P=2.54mm; JLCPCB Part Class: Extended Part; Datasheet: https://atta.szlcsc.com/upload/public/pdf/source/20210301/C2718488_F4427B881E42CAA8DDB0B1C12B3A522C.pdf; Supplier: LCSC; Holes Structure: 1x4P; Pitch: 2.54mm; Circular Hole / Square Hole: Square Holes; Mounting Type: Straight; Number of Rows: Plugin; Number of Holes: 4P; Current Rating (Max): 3A; Holes Direction: Top; Contact Material: bronze; Operating Temperature Range: -40℃~+105℃
MOTOR1 MOTOR2 = PZ254V-11-02P: Pin Structure:1x2P Pitch:2.54mm Row Spacing:- Circluar Pins/Square Pins:Square Pins Mounting Type:Straight Number of Rows:Plugin Number of Pins:2P Current Rating (Max):- Voltage Rating (Max):- Length of Mating Pin:6mm Insulation Height:2.5mm Length of End; LCSC Part Name: 间距:2.54mm 1x2P 直插 方针; Supplier Part: C492401; Manufacturer: XFCN(兴飞); Supplier Footprint: 插件,P=2.54mm; JLCPCB Part Class: Extended Part; Datasheet: https://atta.szlcsc.com/upload/public/pdf/source/20200309/C492401_A812433581A9B211A7FFA413ADDFF0E5.pdf; Supplier: LCSC; Pin Structure: 1x2P; Pitch: 2.54mm; Circluar Pins/Square Pins: Square Pins; Mounting Type: Straight; Number of Rows: Plugin; Number of Pins: 2P; Length of Mating Pin: 6mm; Insulation Height: 2.5mm; Length of End Connection Pin: 3mm; Operating Temperature Range: -40℃~+105℃; Color: Black
ON/OFF = SS12D10G4 071: Circuit:SPDT Actuator Style:- Pin Style:PCPin Switch Length:12.7mm Switch Width:6.7mm Switch Height:6.4mm Mounting Style:Straight Actuator Color:- Current Rating (DC):2A Voltage Rating (DC):125V Current Rating (AC):- Voltage Rating (AC):- Mechanical Life:; Supplier Part: C2887259; Manufacturer: SHOU HAN(首韩); Supplier Footprint: 插件; JLCPCB Part Class: Extended Part; Datasheet: https://atta.szlcsc.com/upload/public/pdf/source/20210820/80D1704BBF3FCEE0435FCAA54C61E0A3.pdf; Supplier: LCSC; Circuit: SPDT; Pin Style: PCPin; Switch Length: 12.7mm; Switch Width: 6.7mm; Switch Height: 6.4mm; Mounting Style: Straight; Current Rating (DC): 2A; Voltage Rating (DC): 125V; Mechanical Life: 3千次; Operating Temperature: -16℃~+60℃
U25 U26 = DRV8838DSGR: LCSC Part Name: 1.8A 有刷直流电机驱动芯片 7V; Supplier Part: C86667; Manufacturer: TI(德州仪器); Supplier Footprint: WSON-8-EP(2x2); JLCPCB Part Class: Extended Part; Datasheet: https://www.ti.com/cn/lit/gpn/drv8838; Supplier: LCSC
U29 = ZLDO1117QK50TC: Supplier Part: C6016205; Manufacturer: DIODES(美台); Supplier Footprint: TO-252; JLCPCB Part Class: Extended Part; Datasheet: https://atta.szlcsc.com/upload/public/pdf/source/20200515/C526778_6D474893D29915DF671E16CD14EB3DFD.pdf; Supplier: LCSC
U33 = LD1117DT33CTR: Output Type:Fixed Maximum Input Voltage:15V Output Voltage:3.3V Output Voltage:3.3V Output Current:800mA Power Supply Rejection Ratio (PSRR):75dB@(120Hz) Dropout Voltage:1.3V@(800mA) standby current:10mA Feature:Thermal Protection(TSD)；Overcurrent Protect; LCSC Part Name: 可调与固定低压降正电压稳压器; Supplier Part: C36395; Manufacturer: ST(意法半导体); Supplier Footprint: TO-252-2(DPAK); JLCPCB Part Class: Extended Part; Datasheet: https://atta.szlcsc.com/upload/public/pdf/source/20200715/C672391_668FCB57B7CEA377EB6BAC1082A27AEF.pdf; Supplier: LCSC; Output Type: Fixed; Maximum Input Voltage: 15V; Output Voltage: 3.3V; Output Current: 800mA; Power Supply Rejection Ratio (PSRR): 75dB@(120Hz); Dropout Voltage: 1.3V@(800mA); standby current: 10mA; Feature: Thermal Protection(TSD)；Overcurrent Protection(OCP); Operating Temperature: -40℃~+125℃; Output Polarity: Positive electrode; Number of Outputs: 1
R9-R20 = 0805W8F4702T5E: Type:Thick Film Resistors Resistance:47kΩ Tolerance:±1% Tolerance:±1% Power(Watts): Overload Voltage (Max): Temperature Coefficient:±100ppm/℃ Temperature Coefficient:±100ppm/℃ Operating Temperature Range:-55℃~+155℃ Operating Temperature Range:-55℃~+155℃; LCSC Part Name: 47kΩ ±1% 125mW 厚膜电阻; Supplier Part: C17713; Manufacturer: UNI-ROYAL(厚声); Supplier Footprint: 0805; JLCPCB Part Class: Basic Part; Datasheet: https://atta.szlcsc.com/upload/public/pdf/source/20200306/C422600_1E6D84923E4A46A82E41ADD87F860B5C.pdf; Supplier: LCSC; Type: Thick Film Resistors; Tolerance: ±1%; Temperature Coefficient: ±100ppm/℃; Operating Temperature Range: -55℃~+155℃
R64-R75 = RTT051870FTP: Type:Thick Film Resistors Resistance: Tolerance:±1% Tolerance:±1% Power(Watts): Overload Voltage (Max): Temperature Coefficient:±100ppm/℃ Temperature Coefficient:±100ppm/℃ Operating Temperature Range:-55℃~+155℃ Operating Temperature Range:-55℃~+155℃; LCSC Part Name: 厚膜电阻 187Ω ±1% 125mW; Supplier Part: C104054; Manufacturer: RALEC(旺诠); Supplier Footprint: 0805; JLCPCB Part Class: Extended Part; Datasheet: https://atta.szlcsc.com/upload/public/pdf/source/20191219/C158410_884373A5B7E1BC76BF57BC45A946C093.pdf; Supplier: LCSC; Type: Thick Film Resistors; Tolerance: ±1%; Temperature Coefficient: ±100ppm/℃; Operating Temperature Range: -55℃~+155℃
U1-U12 = LTH1550-01: Supplier Part: C3040662; Supplier Footprint: DIP-4; JLCPCB Part Class: Extended Part; Supplier: LCSC

## Nets
+3.3V: C6.2 C7.2 C9.2 C10.2 C17.2 C18.2 C25.2 C26.2 DEBUG.1 H1.1 H1.2 IR1.3(VCC) LCD.2 R9.1 R10.2 R11.2 R12.1 R13.2 R14.2 R15.1 R16.2 R17.2 R18.1 R19.2 R20.2 R47.2 R61.2 R62.1 R63.2 R76.2 R77.2 R78.2 U17.2(A) U18.2(A) U25.8(VCC) U26.8(VCC) U32.1(VBAT) U32.13(VDDA) U32.19(VDD_4) U32.32(VDD_1) U32.48(VDD_2) U32.64(VDD_3) U33.4(VOUT)
+5V: C23.2 HC-05.2 R52.2 R64.2 R65.2 R66.2 R67.2 R68.2 R69.2 R70.2 R71.2 R72.2 R73.2 R74.2 R75.2 U16.1(VCC) U29.2(VOUT)
+7.4V: C15.2 C16.2 C22.2 C24.2 ON/OFF.3 U25.1(VM) U26.1(VM) U29.3(VIN) U33.3(VIN)
GND: 7.4VBAT.2 C2.1 C6.1 C7.1 C9.1 C10.1 C11.2 C12.2 C13.2 C14.2 C15.1 C16.1 C17.1 C18.1 C22.1 C23.1 C24.1 C25.1 C26.1 DEBUG.4 DOWN.3 H1.5 H1.6 HC-05.3 IR1.2(GND) LCD.1 MODE.3 R53.1 RST.1 RST.2 U1.1(A) U1.4(EM) U2.1(A) U2.4(EM) U3.1(A) U3.4(EM) U4.1(A) U4.4(EM) U5.1(A) U5.4(EM) U6.1(A) U6.4(EM) U7.1(A) U7.4(EM) U8.1(A) U8.4(EM) U9.1(A) U9.4(EM) U10.1(A) U10.4(EM) U11.1(A) U11.4(EM) U12.1(A) U12.4(EM) U16.5(GND) U16.6(EH) U16.7(EH) U16.8(EH) U16.9(EH) U25.4(GND) U25.9(PAD) U26.4(GND) U26.9(PAD) U29.1(GND) U32.12(VSSA) U32.18(VSS_4) U32.31(VSS_1) U32.47(VSS_2) U32.63(VSS_3) U33.1(GND) UP.3
A0: R9.2 U1.2(C) U32.14(PA0-WKUP)
A1: R10.1 U2.2(C) U32.15(PA1)
A2: R11.1 U3.2(C) U32.16(PA2)
A3: R12.2 U4.2(C) U32.17(PA3)
A4: R13.1 U5.2(C) U32.20(PA4)
A5: R14.1 U6.2(C) U32.21(PA5)
A6: R15.2 U7.2(C) U32.22(PA6)
A7: R16.1 U8.2(C) U32.23(PA7)
A8: R17.1 U9.2(C) U32.26(PB0)
A9: R18.2 U10.2(C) U32.27(PB1)
A10: R19.1 U11.2(C) U32.8(PC0)
A11: R20.1 U12.2(C) U32.9(PC1)
BOOT0: R48.1 U32.60(BOOT0)
BOOT1: R49.2 U32.28(PB2)
BTN1: U32.33(PB12) UP.1
BTN2: DOWN.1 U32.34(PB13)
BTN3: MODE.1 U32.35(PB14)
BTRX: HC-05.5 U32.42(PA9)
BTTX: HC-05.4 U32.43(PA10)
IRSIGNAL: IR1.1(OUT) R76.1 U32.36(PB15)
M1P: U25.6(PH) U32.58(PB6)
M1S: U25.5(EN) U32.59(PB7)
M1SLEEP: R77.1 U25.7(nSLEEP) U32.56(PB4)
M2P: U26.6(PH) U32.61(PB8)
M2S: U26.5(EN) U32.62(PB9)
M2SLEEP: R78.1 U26.7(nSLEEP) U32.57(PB5)
OSC32IN: C13.1 U32.3(PC14-SOC32_IN) X4.2(OSC2)
OSC32OUT: C14.1 U32.4(PC15-SOC32_OUT) X4.1(OSC1)
OSCIN: C12.1 R25.2 U32.5(PD0OSC_IN) X3.1(OSC1)
OSCOUT: C11.1 R25.1 U32.6(PD1OSC_OUT) X3.2(OSC2)
PA11: R50.1 U32.44(PA11)
PA12: R51.1 R52.1 U32.45(PA12)
PC13: R54.1 U32.2(PC13-TAMPER-RTC)
RESET: C2.2 R47.1 RST.3 RST.4 U32.7(NRST)
SCL: LCD.3 U32.29(PB10)
SDA: LCD.4 U32.30(PB11)
SWDCLK: DEBUG.3 U32.49(PA14)
SWDIO: DEBUG.2 U32.46(PA13)
$1N11364: R64.1 U1.3(COL)
$1N11369: R65.1 U2.3(COL)
$1N11378: R66.1 U3.3(COL)
$1N11383: R67.1 U4.3(COL)
$1N11389: R68.1 U5.3(COL)
$1N11395: R69.1 U6.3(COL)
$1N11401: R70.1 U7.3(COL)
$1N11407: R71.1 U8.3(COL)
$1N11413: R72.1 U9.3(COL)
$1N11419: R73.1 U10.3(COL)
$1N11425: R74.1 U11.3(COL)
$1N11431: R75.1 U12.3(COL)
$2N6151: H1.3 R48.2
$2N6190: H1.4 R49.1
$2N8179: R50.2 U16.2(D-)
$2N8185: R51.2 U16.3(D+)
$2N8518: R53.2 U17.1(K)
$2N8616: R54.2 U18.1(K)
$2N15281: R63.1 UP.2
$2N15283: DOWN.2 R62.2
$2N15284: MODE.2 R61.1
$3N3618: MOTOR2.2 U26.2(OUT1)
$3N3619: MOTOR2.1 U26.3(OUT2)
$3N3620: MOTOR1.2 U25.2(OUT1)
$3N3621: MOTOR1.1 U25.3(OUT2)
$3N15654: 7.4VBAT.1 ON/OFF.2

Not connected (* = marked no-connect by the designer): DOWN 4; HC-05 1 6; MODE 4; ON/OFF 1; U16 4(ID); U32 10(PC2) 11(PC3) 24(PC4) 25(PC5) 37(PC6) 38(PC7) 39(PC8) 40(PC9) 41(PA8) 50(PA15) 51(PC10) 52(PC11) 53(PC12) 54(PD2) 55(PB3); UP 4

## Notes on the sheets
sheet 1
- LED Forward Voltage : 1.2V
- LED Forward Current : 20mA
- Resistor value required (Approx.): 5-1.2/20 = 187ohm
- Total current consumption: 20mA * 12 = 240mA
